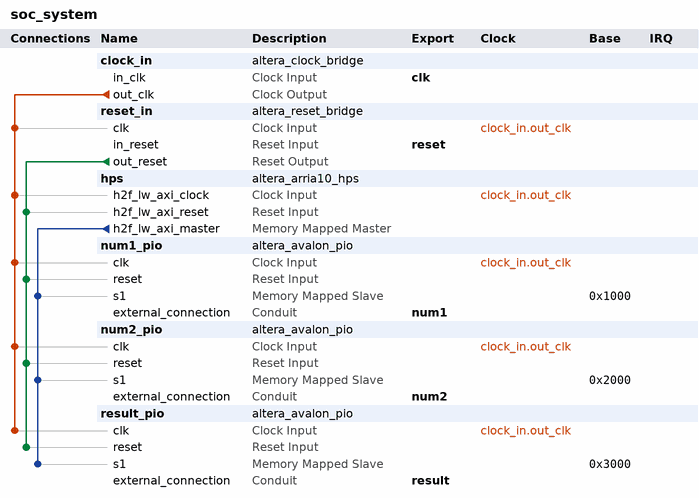
[diagram p0: system contents]
# Platform Designer (Qsys) system soc_system, Arria 10 10AS066N3F40E2SG
# Parameters at their usual value, and those the tool derives, are not listed.
package require -exact qsys 1.0
create_system soc_system
set_project_property DEVICE_FAMILY {Arria 10}
set_project_property DEVICE 10AS066N3F40E2SG

add_component clock_in ip/soc_system/soc_system_clock_in.ip altera_clock_bridge clock_in 18.1
load_component clock_in
set_component_parameter_value DERIVED_CLOCK_RATE 0
set_component_parameter_value EXPLICIT_CLOCK_RATE 50000000
save_component

add_component reset_in ip/soc_system/soc_system_reset_in.ip altera_reset_bridge reset_in 18.1
load_component reset_in
set_component_parameter_value ACTIVE_LOW_RESET 0
set_component_parameter_value SYNCHRONOUS_EDGES deassert
set_component_parameter_value SYNC_RESET 0
save_component

add_instance hps altera_arria10_hps 18.1
set_instance_parameter_value hps BOOT_FROM_FPGA_Enable false
set_instance_parameter_value hps BSEL 1
set_instance_parameter_value hps BSEL_EN false
set_instance_parameter_value hps CLK_EMACA_SOURCE 1
set_instance_parameter_value hps CLK_EMACB_SOURCE 1
set_instance_parameter_value hps CLK_EMAC_PTP_SOURCE 1
set_instance_parameter_value hps CLK_GPIO_SOURCE 1
set_instance_parameter_value hps CLK_HMC_PLL_SOURCE 0
set_instance_parameter_value hps CLK_MAIN_PLL_SOURCE2 0
set_instance_parameter_value hps CLK_MPU_CNT 0
set_instance_parameter_value hps CLK_MPU_SOURCE 0
set_instance_parameter_value hps CLK_NOC_CNT 0
set_instance_parameter_value hps CLK_NOC_SOURCE 0
set_instance_parameter_value hps CLK_PERI_PLL_SOURCE2 0
set_instance_parameter_value hps CLK_S2F_USER0_SOURCE 0
set_instance_parameter_value hps CLK_S2F_USER1_SOURCE 0
set_instance_parameter_value hps CLK_SDMMC_SOURCE 0
set_instance_parameter_value hps CM_Mode N/A
set_instance_parameter_value hps CM_PinMuxing Unused
set_instance_parameter_value hps CTI_Enable false
set_instance_parameter_value hps CUSTOM_MPU_CLK 800
set_instance_parameter_value hps DEBUG_APB_Enable false
set_instance_parameter_value hps DISABLE_PERI_PLL false
set_instance_parameter_value hps DMA_Enable No,No,No,No,No,No,No,No
set_instance_parameter_value hps EMAC0_CLK 250
set_instance_parameter_value hps EMAC0_Mode N/A
set_instance_parameter_value hps EMAC0_PTP false
set_instance_parameter_value hps EMAC0_PinMuxing Unused
set_instance_parameter_value hps EMAC0_SWITCH_Enable false
set_instance_parameter_value hps EMAC1_CLK 250
set_instance_parameter_value hps EMAC1_Mode N/A
set_instance_parameter_value hps EMAC1_PTP false
set_instance_parameter_value hps EMAC1_PinMuxing Unused
set_instance_parameter_value hps EMAC1_SWITCH_Enable false
set_instance_parameter_value hps EMAC2_CLK 250
set_instance_parameter_value hps EMAC2_Mode N/A
set_instance_parameter_value hps EMAC2_PTP false
set_instance_parameter_value hps EMAC2_PinMuxing Unused
set_instance_parameter_value hps EMAC2_SWITCH_Enable false
set_instance_parameter_value hps EMAC_PTP_REF_CLK 100
set_instance_parameter_value hps EMIF_BYPASS_CHECK false
set_instance_parameter_value hps EMIF_CONDUIT_Enable false
set_instance_parameter_value hps F2H_AXI_CLOCK_FREQ 100
set_instance_parameter_value hps F2H_COLD_RST_Enable false
set_instance_parameter_value hps F2H_DBG_RST_Enable false
set_instance_parameter_value hps F2H_DELAY 3
set_instance_parameter_value hps F2H_FREE_CLK_Enable false
set_instance_parameter_value hps F2H_FREE_CLK_FREQ 200
set_instance_parameter_value hps F2H_SDRAM0_CLOCK_FREQ 100
set_instance_parameter_value hps F2H_SDRAM1_CLOCK_FREQ 100
set_instance_parameter_value hps F2H_SDRAM2_CLOCK_FREQ 100
set_instance_parameter_value hps F2H_SDRAM3_CLOCK_FREQ 100
set_instance_parameter_value hps F2H_SDRAM4_CLOCK_FREQ 100
set_instance_parameter_value hps F2H_SDRAM5_CLOCK_FREQ 100
set_instance_parameter_value hps F2H_WARM_RST_Enable false
set_instance_parameter_value hps F2SDRAM0_ENABLED false
set_instance_parameter_value hps F2SDRAM1_ENABLED false
set_instance_parameter_value hps F2SDRAM2_DELAY 4
set_instance_parameter_value hps F2SDRAM2_ENABLED false
set_instance_parameter_value hps F2SDRAM_ADDRESS_WIDTH 32
set_instance_parameter_value hps F2SDRAM_PORT_CONFIG 4
set_instance_parameter_value hps F2SDRAM_READY_LATENCY false
set_instance_parameter_value hps F2SINTERRUPT_Enable false
set_instance_parameter_value hps F2S_Width 0
set_instance_parameter_value hps FPGA_PERIPHERAL_INPUT_CLOCK_FREQ_EMAC0_RX_CLK_IN 100
set_instance_parameter_value hps FPGA_PERIPHERAL_INPUT_CLOCK_FREQ_EMAC0_TX_CLK_IN 100
set_instance_parameter_value hps FPGA_PERIPHERAL_INPUT_CLOCK_FREQ_EMAC1_RX_CLK_IN 100
set_instance_parameter_value hps FPGA_PERIPHERAL_INPUT_CLOCK_FREQ_EMAC1_TX_CLK_IN 100
set_instance_parameter_value hps FPGA_PERIPHERAL_INPUT_CLOCK_FREQ_EMAC2_RX_CLK_IN 100
set_instance_parameter_value hps FPGA_PERIPHERAL_INPUT_CLOCK_FREQ_EMAC2_TX_CLK_IN 100
set_instance_parameter_value hps FPGA_PERIPHERAL_INPUT_CLOCK_FREQ_EMAC_PTP_REF_CLOCK 100
set_instance_parameter_value hps FPGA_PERIPHERAL_INPUT_CLOCK_FREQ_I2C0_SCL_IN 100
set_instance_parameter_value hps FPGA_PERIPHERAL_INPUT_CLOCK_FREQ_I2C1_SCL_IN 100
set_instance_parameter_value hps FPGA_PERIPHERAL_INPUT_CLOCK_FREQ_I2CEMAC0_SCL_IN 100
set_instance_parameter_value hps FPGA_PERIPHERAL_INPUT_CLOCK_FREQ_I2CEMAC1_SCL_IN 100
set_instance_parameter_value hps FPGA_PERIPHERAL_INPUT_CLOCK_FREQ_I2CEMAC2_SCL_IN 100
set_instance_parameter_value hps FPGA_PERIPHERAL_INPUT_CLOCK_FREQ_SDMMC_CLK_IN 100
set_instance_parameter_value hps FPGA_PERIPHERAL_INPUT_CLOCK_FREQ_SPIS0_SCLK_IN 100
set_instance_parameter_value hps FPGA_PERIPHERAL_INPUT_CLOCK_FREQ_SPIS1_SCLK_IN 100
set_instance_parameter_value hps FPGA_PERIPHERAL_INPUT_CLOCK_FREQ_USB0_CLK_IN 100
set_instance_parameter_value hps FPGA_PERIPHERAL_INPUT_CLOCK_FREQ_USB1_CLK_IN 100
set_instance_parameter_value hps FPGA_PERIPHERAL_OUTPUT_CLOCK_FREQ_EMAC0_GTX_CLK 100
set_instance_parameter_value hps FPGA_PERIPHERAL_OUTPUT_CLOCK_FREQ_EMAC0_MD_CLK 2.5
set_instance_parameter_value hps FPGA_PERIPHERAL_OUTPUT_CLOCK_FREQ_EMAC1_GTX_CLK 100
set_instance_parameter_value hps FPGA_PERIPHERAL_OUTPUT_CLOCK_FREQ_EMAC1_MD_CLK 2.5
set_instance_parameter_value hps FPGA_PERIPHERAL_OUTPUT_CLOCK_FREQ_EMAC2_GTX_CLK 100
set_instance_parameter_value hps FPGA_PERIPHERAL_OUTPUT_CLOCK_FREQ_EMAC2_MD_CLK 2.5
set_instance_parameter_value hps FPGA_PERIPHERAL_OUTPUT_CLOCK_FREQ_I2C0_CLK 100
set_instance_parameter_value hps FPGA_PERIPHERAL_OUTPUT_CLOCK_FREQ_I2C1_CLK 100
set_instance_parameter_value hps FPGA_PERIPHERAL_OUTPUT_CLOCK_FREQ_I2CEMAC0_CLK 100
set_instance_parameter_value hps FPGA_PERIPHERAL_OUTPUT_CLOCK_FREQ_I2CEMAC1_CLK 100
set_instance_parameter_value hps FPGA_PERIPHERAL_OUTPUT_CLOCK_FREQ_I2CEMAC2_CLK 100
set_instance_parameter_value hps FPGA_PERIPHERAL_OUTPUT_CLOCK_FREQ_QSPI_SCLK_OUT 100
set_instance_parameter_value hps FPGA_PERIPHERAL_OUTPUT_CLOCK_FREQ_SDMMC_CCLK 100
set_instance_parameter_value hps FPGA_PERIPHERAL_OUTPUT_CLOCK_FREQ_SPIM0_SCLK_OUT 100
set_instance_parameter_value hps FPGA_PERIPHERAL_OUTPUT_CLOCK_FREQ_SPIM1_SCLK_OUT 100
set_instance_parameter_value hps GPIO_REF_CLK 4
set_instance_parameter_value hps GP_Enable false
set_instance_parameter_value hps H2F_AXI_CLOCK_FREQ 100
set_instance_parameter_value hps H2F_COLD_RST_Enable false
set_instance_parameter_value hps H2F_CTI_CLOCK_FREQ 100
set_instance_parameter_value hps H2F_DEBUG_APB_CLOCK_FREQ 100
set_instance_parameter_value hps H2F_DELAY 3
set_instance_parameter_value hps H2F_LW_AXI_CLOCK_FREQ 50000000
set_instance_parameter_value hps H2F_LW_DELAY 3
set_instance_parameter_value hps H2F_PENDING_RST_Enable false
set_instance_parameter_value hps H2F_TPIU_CLOCK_IN_FREQ 100
set_instance_parameter_value hps H2F_USER0_CLK_Enable false
set_instance_parameter_value hps H2F_USER0_CLK_FREQ 400
set_instance_parameter_value hps H2F_USER1_CLK_Enable false
set_instance_parameter_value hps H2F_USER1_CLK_FREQ 400
set_instance_parameter_value hps HMC_PLL_REF_CLK 800
set_instance_parameter_value hps HPS_DIV_GPIO_FREQ 125
set_instance_parameter_value hps HPS_IO_Enable unused,unused,unused,unused,unused,unused,unused,unused,unused,unused,unused,unused,unused,unused,unused,unused,unused,unused,unused,unused,unused,unused,unused,unused,unused,unused,unused,unused,unused,unused,unused,unused,unused,unused,unused,unused,unused,unused,unused,unused,unused,unused,unused,unused,unused,unused,unused,unused,unused,unused,unused,unused,unused,unused,unused,unused,unused,unused,unused,unused,unused,unused
set_instance_parameter_value hps I2C0_Mode N/A
set_instance_parameter_value hps I2C0_PinMuxing Unused
set_instance_parameter_value hps I2C1_Mode N/A
set_instance_parameter_value hps I2C1_PinMuxing Unused
set_instance_parameter_value hps I2CEMAC0_Mode N/A
set_instance_parameter_value hps I2CEMAC0_PinMuxing Unused
set_instance_parameter_value hps I2CEMAC1_Mode N/A
set_instance_parameter_value hps I2CEMAC1_PinMuxing Unused
set_instance_parameter_value hps I2CEMAC2_Mode N/A
set_instance_parameter_value hps I2CEMAC2_PinMuxing Unused
set_instance_parameter_value hps INTERNAL_OSCILLATOR_ENABLE 60
set_instance_parameter_value hps JTAG_Enable false
set_instance_parameter_value hps L3_MAIN_FREE_CLK 400
set_instance_parameter_value hps L4_SYS_FREE_CLK 1
set_instance_parameter_value hps LWH2F_Enable 2
set_instance_parameter_value hps MPU_CLK_VCCL 0
set_instance_parameter_value hps MPU_EVENTS_Enable false
set_instance_parameter_value hps NAND_Mode N/A
set_instance_parameter_value hps NAND_PinMuxing Unused
set_instance_parameter_value hps NOCDIV_CS_ATCLK 0
set_instance_parameter_value hps NOCDIV_CS_PDBGCLK 1
set_instance_parameter_value hps NOCDIV_CS_TRACECLK 0
set_instance_parameter_value hps NOCDIV_L4MAINCLK 0
set_instance_parameter_value hps NOCDIV_L4MPCLK 1
set_instance_parameter_value hps NOCDIV_L4SPCLK 2
set_instance_parameter_value hps OVERIDE_PERI_PLL false
set_instance_parameter_value hps PERI_PLL_MANUAL_VCO_FREQ 2000
set_instance_parameter_value hps PLL_CLK0 Unused
set_instance_parameter_value hps PLL_CLK1 Unused
set_instance_parameter_value hps PLL_CLK2 Unused
set_instance_parameter_value hps PLL_CLK3 Unused
set_instance_parameter_value hps PLL_CLK4 Unused
set_instance_parameter_value hps QSPI_Mode N/A
set_instance_parameter_value hps QSPI_PinMuxing Unused
set_instance_parameter_value hps RUN_INTERNAL_BUILD_CHECKS 0
set_instance_parameter_value hps S2FINTERRUPT_CLOCKPERIPHERAL_Enable false
set_instance_parameter_value hps S2FINTERRUPT_CTI_Enable false
set_instance_parameter_value hps S2FINTERRUPT_DMA_Enable false
set_instance_parameter_value hps S2FINTERRUPT_EMAC0_Enable false
set_instance_parameter_value hps S2FINTERRUPT_EMAC1_Enable false
set_instance_parameter_value hps S2FINTERRUPT_EMAC2_Enable false
set_instance_parameter_value hps S2FINTERRUPT_FPGAMANAGER_Enable false
set_instance_parameter_value hps S2FINTERRUPT_GPIO_Enable false
set_instance_parameter_value hps S2FINTERRUPT_HMC_Enable false
set_instance_parameter_value hps S2FINTERRUPT_I2C0_Enable false
set_instance_parameter_value hps S2FINTERRUPT_I2C1_Enable false
set_instance_parameter_value hps S2FINTERRUPT_I2CEMAC0_Enable false
set_instance_parameter_value hps S2FINTERRUPT_I2CEMAC1_Enable false
set_instance_parameter_value hps S2FINTERRUPT_I2CEMAC2_Enable false
set_instance_parameter_value hps S2FINTERRUPT_L4TIMER_Enable false
set_instance_parameter_value hps S2FINTERRUPT_NAND_Enable false
set_instance_parameter_value hps S2FINTERRUPT_QSPI_Enable false
set_instance_parameter_value hps S2FINTERRUPT_SDMMC_Enable false
set_instance_parameter_value hps S2FINTERRUPT_SPIM0_Enable false
set_instance_parameter_value hps S2FINTERRUPT_SPIM1_Enable false
set_instance_parameter_value hps S2FINTERRUPT_SPIS0_Enable false
set_instance_parameter_value hps S2FINTERRUPT_SPIS1_Enable false
set_instance_parameter_value hps S2FINTERRUPT_SYSTEMMANAGER_Enable false
set_instance_parameter_value hps S2FINTERRUPT_SYSTIMER_Enable false
set_instance_parameter_value hps S2FINTERRUPT_UART0_Enable false
set_instance_parameter_value hps S2FINTERRUPT_UART1_Enable false
set_instance_parameter_value hps S2FINTERRUPT_USB0_Enable false
set_instance_parameter_value hps S2FINTERRUPT_USB1_Enable false
set_instance_parameter_value hps S2FINTERRUPT_WATCHDOG_Enable false
set_instance_parameter_value hps S2F_Width 0
set_instance_parameter_value hps SDMMC_Mode N/A
set_instance_parameter_value hps SDMMC_PinMuxing Unused
set_instance_parameter_value hps SDMMC_REF_CLK 200
set_instance_parameter_value hps SECURITY_MODULE_Enable false
set_instance_parameter_value hps SPIM0_Mode N/A
set_instance_parameter_value hps SPIM0_PinMuxing Unused
set_instance_parameter_value hps SPIM1_Mode N/A
set_instance_parameter_value hps SPIM1_PinMuxing Unused
set_instance_parameter_value hps SPIS0_Mode N/A
set_instance_parameter_value hps SPIS0_PinMuxing Unused
set_instance_parameter_value hps SPIS1_Mode N/A
set_instance_parameter_value hps SPIS1_PinMuxing Unused
set_instance_parameter_value hps STM_Enable false
set_instance_parameter_value hps TESTIOCTRL_DEBUGCLKSEL 16
set_instance_parameter_value hps TESTIOCTRL_MAINCLKSEL 8
set_instance_parameter_value hps TESTIOCTRL_PERICLKSEL 8
set_instance_parameter_value hps TEST_Enable false
set_instance_parameter_value hps TRACE_Mode N/A
set_instance_parameter_value hps TRACE_PinMuxing Unused
set_instance_parameter_value hps UART0_Mode N/A
set_instance_parameter_value hps UART0_PinMuxing Unused
set_instance_parameter_value hps UART1_Mode N/A
set_instance_parameter_value hps UART1_PinMuxing Unused
set_instance_parameter_value hps USB0_Mode N/A
set_instance_parameter_value hps USB0_PinMuxing Unused
set_instance_parameter_value hps USB1_Mode N/A
set_instance_parameter_value hps USB1_PinMuxing Unused
set_instance_parameter_value hps USE_DEFAULT_MPU_CLK false
set_instance_parameter_value hps device_name 10AS066N3F40E2SG
set_instance_parameter_value hps eosc1_clk_mhz 25.0
set_instance_parameter_value hps quartus_ini_hps_ip_boot_from_fpga_ready false
set_instance_parameter_value hps quartus_ini_hps_ip_enable_a10_advanced_options false
set_instance_parameter_value hps quartus_ini_hps_ip_enable_jtag false
set_instance_parameter_value hps quartus_ini_hps_ip_enable_sdmmc_clk_in false
set_instance_parameter_value hps quartus_ini_hps_ip_enable_test_interface false
set_instance_parameter_value hps quartus_ini_hps_ip_overide_f2sdram_delay false
set_instance_parameter_value hps quartus_ini_hps_ip_override_sdmmc_4bit false

add_component num1_pio ip/soc_system/soc_system_num_1.ip altera_avalon_pio num1_pio 18.1

add_component num2_pio ip/soc_system/soc_system_num_1.ip altera_avalon_pio num2_pio 18.1

add_component result_pio ip/soc_system/soc_system_result.ip altera_avalon_pio result_pio 18.1

# connections
add_connection clock_in.out_clk hps.h2f_lw_axi_clock clock
add_connection clock_in.out_clk num1_pio.clk clock
add_connection clock_in.out_clk num2_pio.clk clock
add_connection clock_in.out_clk reset_in.clk clock
add_connection clock_in.out_clk result_pio.clk clock
add_connection reset_in.out_reset hps.h2f_lw_axi_reset reset
add_connection reset_in.out_reset num1_pio.reset reset
add_connection reset_in.out_reset num2_pio.reset reset
add_connection reset_in.out_reset result_pio.reset reset
add_connection hps.h2f_lw_axi_master num1_pio.s1 avalon
set_connection_parameter_value hps.h2f_lw_axi_master/num1_pio.s1 baseAddress 0x1000
add_connection hps.h2f_lw_axi_master num2_pio.s1 avalon
set_connection_parameter_value hps.h2f_lw_axi_master/num2_pio.s1 baseAddress 0x2000
add_connection hps.h2f_lw_axi_master result_pio.s1 avalon
set_connection_parameter_value hps.h2f_lw_axi_master/result_pio.s1 baseAddress 0x3000

# exported interfaces
add_interface clk clock sink
set_interface_property clk EXPORT_OF clock_in.in_clk
add_interface num1 conduit end
set_interface_property num1 EXPORT_OF num1_pio.external_connection
add_interface num2 conduit end
set_interface_property num2 EXPORT_OF num2_pio.external_connection
add_interface reset reset sink
set_interface_property reset EXPORT_OF reset_in.in_reset
add_interface result conduit end
set_interface_property result EXPORT_OF result_pio.external_connection

set_interconnect_requirement {$system} qsys_mm.clockCrossingAdapter HANDSHAKE
set_interconnect_requirement {$system} qsys_mm.enableEccProtection FALSE
set_interconnect_requirement {$system} qsys_mm.insertDefaultSlave FALSE
set_interconnect_requirement {$system} qsys_mm.maxAdditionalLatency 1

save_system soc_system.qsys
